# Altium schematic sheet Oscar_MainBoard_Flash.SchDoc
size A4
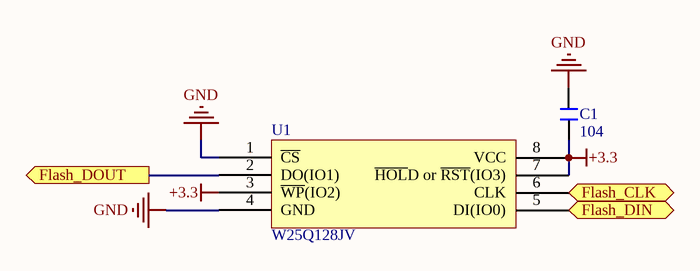
[diagram p0: Oscar_MainBoard_Flash.SchDoc]

## Parts
C1  104  [C 0402_L]
U1  W25Q128JV  [WSON-8_5X6MM]

## Ports
Flash_CLK (in), Flash_DIN (in), Flash_DOUT (out)

## Nets
+3.3: C1.1 U1.3(~{WP}(IO2)) U1.7(~{HOL}D_or_~{RST}(IO3)) U1.8(VCC)
GND: C1.2 U1.1(~{CS}) U1.4(GND)
Flash_CLK: U1.6(CLK) ; port Flash_CLK
Flash_DIN: U1.5(DI(IO0)) ; port Flash_DIN
Flash_DOUT: U1.2(DO(IO1)) ; port Flash_DOUT

## Library data of the parts
C1 = C: 贴片电容; BOM名称: 无极性贴片电容; 优秀评价可免费更新: 联系淘宝ID：黄晶宝石，获取更新版封装库; 卖家免费技术支持，联系售后: 唯一出售店铺网址https://shop463601444.taobao.com; 本封装库来自淘宝卖家 ID：黄晶宝石: 其他店铺购入均为盗版，请立即申请退款
U1 = W25Q128JV: 128Mbit